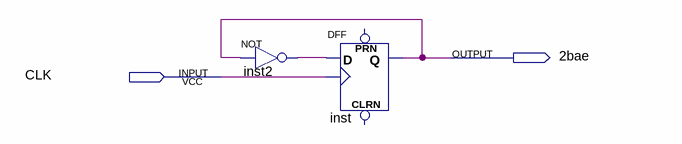
[diagram p0: schematic sheet]
// Quartus schematic 2bae.bdf as structural Verilog: 2 symbols, 2 pins
module \2bae  (
  input  CLK,
  output \2bae 
);

  wire inst2_out;

  not inst2 (inst2_out, \2bae );
  DFF inst (.CLK(CLK), .D(inst2_out), .Q(\2bae ));  // open: CLRN, PRN
endmodule
